# Altium schematic sheet Motion_Control_Inputs.SchDoc
size Letter; SheetNumber: 1; SheetTotal: 2
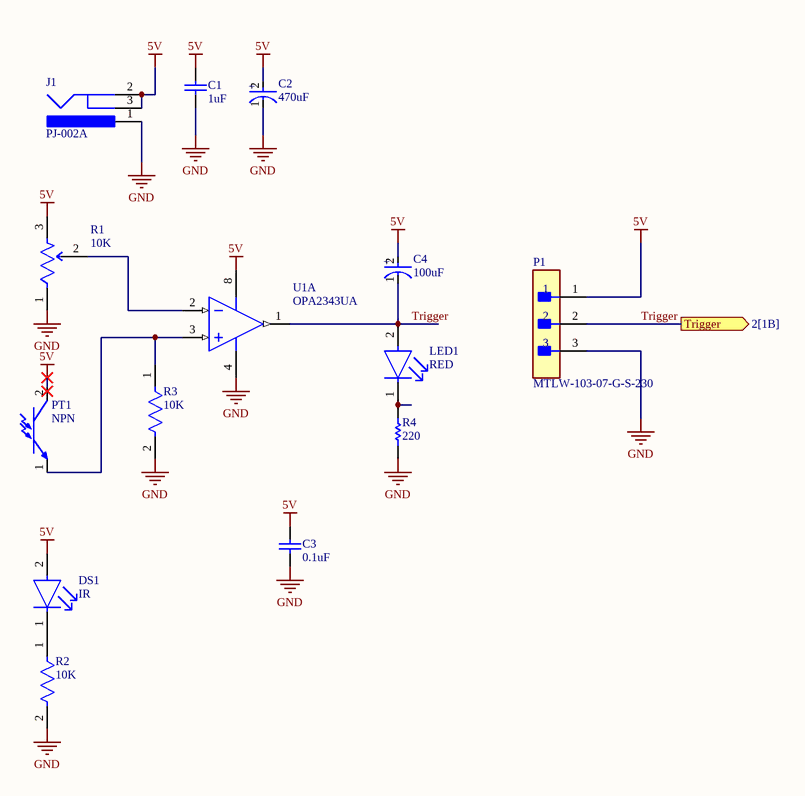
[diagram p0: Motion_Control_Inputs.SchDoc]

## Parts
C1  1uF  [CAPC2013X100X50ML20T25]
C2  470uF  [FP-TR3E-MFG]
C3  0.1uF  [CAPC2013X145X50ML20T20]
C4  100uF  [FP-TR3B-MFG]
DS1  IR  [FP-SFH_4554-MFG]
J1  PJ-002A  [CUI-PJ-002A_V]
LED1  RED  [FP-HLMP-4700-MFG]
P1  MTLW-103-07-G-S-230  [FP-MTLW-103-07-G-S-230-MFG]
PT1  NPN  [PhotoTr_PT334-6C]
R1  10K  [FP-TS53YL-MFG]
R2  10K  [FP-RP73P-2A-IPC_B]
R3  10K  [FP-RP73P-2A-IPC_B]
R4  220  [RESC2013X60X30NL20T20]
U1  OPA2343UA  [D0008A_N]  (part A of 2)

## Ports
Trigger (out, see 2[1B])

## Nets
5V: C1.2 C2.2(A) C3.2 C4.2(A) DS1.2(A) J1.2 J1.3 P1.1 PT1.2(C) R1.3(c) U1.8(V+)
GND: C1.1 C2.1(C) C3.1 J1.1 P1.3 R1.1(a) R2.2 R3.2 R4.2 U1.4(V-)
Trigger: C4.1(C) LED1.2(A) P1.2 U1.1(OUT_A) ; port Trigger
NetDS1_1: DS1.1(C) R2.1
NetLED1_1: LED1.1(C) R4.1
NetPT1_1: PT1.1(E) R3.1 U1.3(IN_A+)
NetR1_2: R1.2(b) U1.2(IN_A-)

## Notes on the sheet
- (in symbol CAP Pol 100uF 10V SMT) +
- (in symbol CAP Pol 470uF 10V SMD) +

## Library data of the parts
C1 = CAP 1uF 10V 0805: Part Number: C0805X105K8RACTU; Manufacturer: Kemet
C2 = CAP Pol 470uF 10V SMD: TR3E477K010C0100 Cap Tant Solid 470uF 10V E CASE 10% (7.3 X 4.3 X 4mm) Inward L SMD 7343-43 0.1 Ohm 125C T/R; NexarPartId: 11565183; ESR (Equivalent Series Resistance): 100mΩ; Polarity: Polar; Leakage Current: 47µA; Dielectric Material: Tantalum; Capacitance: 470µF; Dissipation Factor: 15%; Ripple Current: 1.28A; Radiation Hardening: No; Case Code (Metric): 7343; Min Operating Temperature: -55°C; Voltage Rating (DC): 10V; Length: 7.3mm; RoHS: Compliant; Voltage Rating: 10V; Voltage: 10V; Height: 4mm; Mount: Surface Mount; Schedule B: 8532210050, 8532210050|8532210050|8532210050|8532210050|8532210050; Case/Package: Molded; REACH SVHC: Unknown; Packaging: Cut Tape; Depth: 4.3mm; Number of Pins: 2; Termination: SMD/SMT; Max Operating Temperature: 125°C; Width: 4.3mm; Case Code (Imperial): 2917; Tolerance: 10%
C3 = CAP 0.1uF 10V 0805: Manufacturer: Vitramon; Part Number: VJ0805Y104MXQCW1BC
C4 = CAP Pol 100uF 10V SMT: TR3B107M010C1400 Cap Tant Solid 100uF 10V B CASE 20% (3.5 X 2.8 X 1.9mm) Inward L SMD 3528-21 1.4 Ohm 125C T/R; NexarPartId: 44433230; Polarity: Polar; Leakage Current: 10µA; Dissipation Factor: 25%; Ripple Current: 250mA; ESR (Equivalent Series Resistance): 1.4Ω; Capacitance: 100µF; Max Operating Temperature: 125°C; Height - Seated (Max): 2.1082mm; Mount: Surface Mount; Case/Package: 1411; Features: General Purpose; Lead Free: Lead Free; RoHS: Compliant; Tolerance: 20%; Height: 2.1mm; Depth: 2.8mm; Termination: SMD/SMT; Voltage Rating (DC): 10V; Min Operating Temperature: -55°C; Case Code (Imperial): 1411; Case Code (Metric): 3528; Schedule B: 8532210050, 8532210050|8532210050, 8532210050|8532210050|8532210050, 8532210050|8532210050|8532210050|8532210050; Voltage Rating: 10V; Length: 3.5mm; REACH SVHC: Unknown; Packaging: Cut Tape; Width: 2.794mm; Number of Pins: 2
DS1 = IR Emitter 5mm: EMITTER IR 850NM; Manufacturer: Osram Opto; Forward Voltage: 1.7V; Viewing Angle: 20°; Forward Current: 100mA; Led Orientation: Straight; Colour: Infrared; Power Dissipation: 200mW; Peak Emmision Wavelength: 860nm; Reverse Voltage: 5V; Manufacturer Part Number: SFH 4554; Automotive: No; Category: Diode; Octopart: https://octopart.com/sfh+4554-osram+opto-55819455; ComponentLink2URL: https://forum.upverter.com/uploads/short-url/9WLvpCRBrQtL1CWwnUt39ojzKI8.pdf; Device Class L1: Optoelectronics; Device Class L3: unset; Temperature Range Low: -40°C; Mouser Description: Infrared Emitter 850nm 550mW/sr Circular Top Mount 2-Pin T-1 3/4; Lead Free: Yes; ComponentLink2Description: Datasheet; Temperature: -40°C to +100°C; RoHS: TRUE; Temperature Range High: +100°C; Digikey Description: EMITTER IR 850NM; Device Class L2: LEDs; Package: SFH_4554
J1 = Connector DC Power Jack 2mm: Through Hole Right Angle DC Power Jack, 2.5 A, 2 mm Center Pin, 3 Position, -25 to 85 degC, RoHS, Bulk; Manufacturer: CUIInc.; Brand: CUI; Inside Contact Diameter: 2mm; Voltage Rating: 24V; Outside Contact Diameter: 6.5mm; Current Rating: 2.5A; Insulation Resistance: 50MOhms; Contact Gender: Male; Connector Type: DCPowerJack; Datasheet Version: Rev. 1.03, 04/2016; Housing Material: PolybutyleneTerephthalate(PBT); Operating Temperature Range: -25Cto+85C; Termination Style: ThroughHole; Product Category: DCPowerConnectors; Mounting Technology: ThroughHole; Mounting Style: ThroughHole; Factory Pack Quantity: 500; Contact Plating: Nickel; Package Reference: PJ-002A; Mounting Angle: Right; Package Description: 3-Pin Through Hole Device, Body 14.4 x 9 mm, Height 11 mm; Flammability Rating: UL94V-0; Manufacturer URL: http://www.cui.com/; Product: Jacks; Contact Material: Copper; Datasheet URL: http://www.cui.com/product/resource/pj-002a.pdf; RoHS: True
LED1 = LED 5mm Red: LED RED DIFFUSED T-1 3/4 T/H; Manufacturer: Broadcom; Luminous Intensity: 2.3mcd; Peak Emmision Wavelength: 635nm; Forward Voltage: 1.7V; Viewing Angle: 50°; Led Orientation: Straight; Reverse Voltage: 5V; Forward Current: 2mA; Power Dissipation: 14mW; Wavelength: 626nm; Digikey Description: LED RED DIFFUSED T-1 3/4 T/H; Device Class L3: unset; Temperature Range Low: -40°C; Temperature Range High: +100°C; RoHS: TRUE; Package: HLMP-4700; Octopart: https://octopart.com/hlmp-4700-broadcom-71130526; Automotive: No; ComponentLink2URL: https://docs.broadcom.com/docs/AV02-1557EN; Colour: Red; Temperature: -40°C to +100°C; Lead Free: Yes; Category: Diode; ComponentLink2Description: Datasheet; Manufacturer Part Number: HLMP-4700; Device Class L1: Optoelectronics; Device Class L2: LEDs; Mouser Description: LED; Red; 2.3mcd; 0.24In.Dia.; T-1-3/4; 500mA; 1.7V; 635nm; 50deg; 5V; 24mW; -55degC;
P1 = Header 3POS 2.54mm TH Single Row: CONN HEADER VERT 3POS 2.54MM; Max Current Rating: 3A; Number of Contacts: 3; Gender: Male; Contact Material: Bronze; Pitch: 2.54mm; Housing Material: Polymer; Contact Plating: Gold; Radiation Hardening: No; Depth: 2.48mm; Packaging: Bulk; Number of Rows: 1; Max Operating Temperature: 125°C; Housing Color: Black; Termination: Solder; Min Operating Temperature: -55°C; Length: 7.62mm; RoHS Compliant: Yes; Orientation: Straight
PT1 = Phototransistor 5mm: Phototransistor Chip Silicon 940nm 2-Pin T-1 Bag / 5mm Phototransistor, T-1 3/4; Manufacturer: Everlight; Manufacturer Part Number: PT334-6B
R1 = Res 10K Trimmer: TRIMMER 10K OHM 0.25W GW TOP ADJ; Power Rating: 250mW; Number of Turns: 1; Resistance Tolerance: 20%; Resistance: 10kR; Temperature Coefficient: 100ppm/°C; Mount: Surface Mount; Max Operating Temperature: 125°C; Military Standard: Not; Min Operating Temperature: -55°C; Series: TS53Y; Lead Free: Lead Free; Resistor Type: Cermet; Length: 5mm; Termination: Gull Wing; RoHS Compliant: Yes; Tolerance: 20%; Taper: Linear; Height: 2.7mm; Package Quantity: 1; Width: 5mm; Depth: 6.4mm; Technology: CERMET; Packaging: Tape and Reel; Max Power Dissipation: 250mW; Radiation Hardening: No
R2 R3 = Res 10K 0.25W SMD: RP73P 0805 10KΩ 0.25W 25ppm/°C 0.10% 150V; Manufacturer Part Number: RP73PF2A10KBTDF; Manufacturer: TE Connectivity; Tolerance: 0.001; Package: RP73P-2A; ComponentLink2URL: https://www.te.com/commerce/DocumentDelivery/DDEController?Action=srchrtrv&DocNm=1773272&DocType=DS&DocLang=English; Series: RP73P; ComponentLink2Description: Datasheet; RoHS: TRUE; Category: Res; Device Class L3: Chip SMD Resistors; Device Class L2: Resistors; Device Class L1: Passive Components; Temperature: -55°C to +155°C; Temperature Coefficient: 25ppm/°C; Temperature Range Low: -55°C; Power Rating: 0.25W; Octopart: https://octopart.com/2176093-5-te+connectivity-46441071; Ipc Land Pattern Name: RESC200125X55; Automotive: No; Resistance: 10KΩ; Composition: Thin Film; Lead Free: Yes; Value: 10KΩ; Height: 0.65mm; Voltage Rating: 150V; Temperature Range High: +155°C
R4 = Res 220 Ohm 0.25W SMD: Part Number: SG73S2ATTD2200F; Manufacturer: KOA Speer
U1 = IC OpAmp General Purpose Dual Circuit: Single-Supply, Rail-to-Rail Operational Amplifier MicroAmplifier(TM) Series, 2.7 to 5.5 V, -40 to 85 degC, 8-pin SOIC (D8), Green (RoHS & no Sb/Br); Manufacturer: Texas Instruments; Slew Rate(Typ)(V/us): 6; Offset Drift(Typ)(uV/C): 3; Sub Family: High Output Current Amplifier (>=50mA), Low Input Bias Current Amp (<=10pA), Low Supply Voltage Amplifier (<=2.7V), Precision Amplifier; Rating: Catalog; IIB(Max)(pA): 10; CMRR(Min)(dB): 74; Number of Channels: 2; Vio (25C)(Max)(mV): 8; Total Supply Voltage(Max)(+5V is 5, +/-5V is 10): 5.5; Packing: TUBE; Total Supply Voltage(Min)(+5V is 5, +/-5V is 10): 2.7; Iq per channel(Max)(mA): 1.25; ComponentLink2Description: Datasheet; Eco-Plan: Green (RoHS & no Sb/Br); Mounting Technology: Surface Mount; PartNumber: OPA2343UA; Code_JEDEC: MS-012; ComponentLink1Description: Manufacturer URL; ComponentLink3Description: Package Specification; GBW(Typ)(MHz): 5.5; ComponentLink2URL: http://www.ti.com/lit/ds/symlink/opa2343.pdf; DatasheetVersion: SBOS090A; ComponentLink1URL: http://www.ti.com/; PackageReference: D0008A; PackageDescription: 8-Pin Plastic Small Outline, Body 4.9 x 3.9 mm, Pitch 1.27 mm; ComponentLink3URL: http://www.ti.com/litv/pdf/msoi002j; PackageVersion: 4040047-3/M, 06/2011